# EAGLE schematic LDO Design Block (EAGLE 9.6.2)
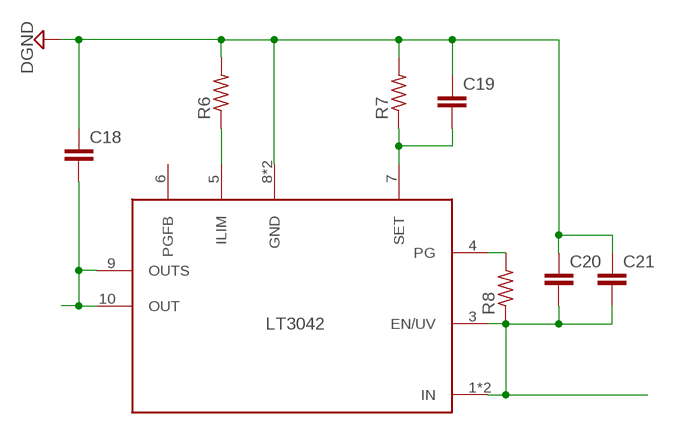
[diagram p0: schematic, sheet 1]

## Parts
C18  C-EUC0805K  [C0805K]
C19  C-EUC1206K  [C1206K]
C20  C-EUC0805K  [C0805K]
C21  C-EUC0805K  [C0805K]
LDO6  LT3042  [SOP50P490X110-11N]
R6  R-US_R0805  [R0805]
R7  R-US_R0805  [R0805]
R8  R-US_R0805  [R0805]

## Nets
DGND: C18.1 C19.1 C20.1 C21.1 LDO6.8(GND) LDO6.11(GND) R6.2 R7.2
N$38: LDO6.5(ILIM) R6.1
N$53: C19.2 LDO6.7(SET) R7.1
N$54: LDO6.4(PG) R8.2
N$63: C20.2 C21.2 LDO6.1(IN) LDO6.2(IN) LDO6.3(EN/UV) R8.1
N$135: C18.2 LDO6.9(OUTS) LDO6.10(OUT)
Unconnected: LDO6.6(PGFB)

## Library data of the parts
C18-C21 = rcl:C-EU: CAPACITOR, European symbol; SPICEPREFIX: C
LDO6 = LT3042EMSE#PBF:LT3042: LINEAR TECHNOLOGY - LT3042EMSE#PBF - LDO, ADJ, 0.2A, 0V-15V, MSOP-10 Source: Datasheet <http://www.linear.com/docs/46159>; DESCRIPTION: LINEAR TECHNOLOGY - LT3042EMSE#PBF - LDO, ADJ, 0.2A, 0V-15V, MSOP-10; HEIGHT: 1.1mm; MANUFACTURER_NAME: Linear Technology; MANUFACTURER_PART_NUMBER: LT3042EMSE#PBF; MOUSER_PART_NUMBER: 584-LT3042EMSE#PBF; MOUSER_PRICE-STOCK: https://www.mouser.co.uk/ProductDetail/Analog-Devices-Linear-Technology/LT3042EMSEPBF?qs=oahfZPh6IAJ3XP16d20ITw%3D%3D
R6-R8 = rcl:R-US_: RESISTOR, American symbol; SPICEPREFIX: R